# Altium schematic sheet MCU_Board_fNIRS_POWER.SchDoc
size A; SheetNumber: 2; SheetTotal: 2
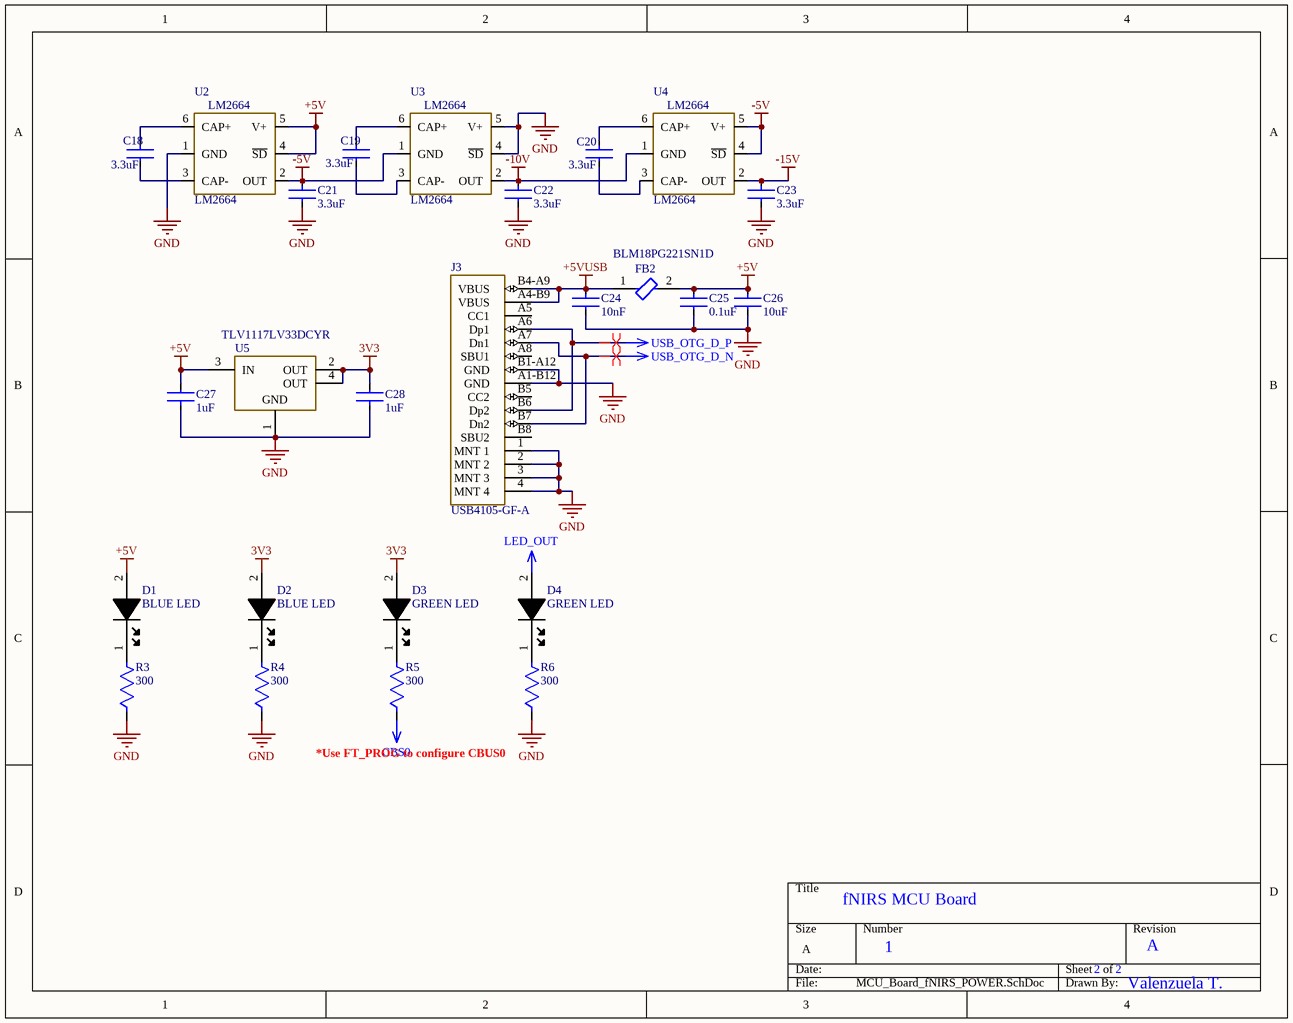
[diagram p0: MCU_Board_fNIRS_POWER.SchDoc]

## Parts
C18  3.3uF  [CAPC1210(3225)190_M]
C19  3.3uF  [CAPC1210(3225)190_M]
C20  3.3uF  [CAPC1210(3225)190_M]
C21  3.3uF  [CAPC1210(3225)190_M]
C22  3.3uF  [CAPC1210(3225)190_M]
C23  3.3uF  [CAPC1210(3225)190_M]
C24  10nF  [CAPC1206(3216)130_M]
C25  0.1uF  [CAPC3216X180N]
C26  10uF  [CAPC3216X180N]
C27  1uF  [CAPC3216X180N]
C28  1uF  [CAPC3216X180N]
D1  BLUE LED  [XZCFBB54W-1VF]
D2  BLUE LED  [XZCFBB54W-1VF]
D3  GREEN LED  [XZCFBB54W-1VF]
D4  GREEN LED  [XZCFBB54W-1VF]
FB2  BLM18PG221SN1D  [BEADC1608X95N]
J3  USB4105-GF-A  [FP-USB4105-GF-A-MFG]
R3  300  [R1206]
R4  300  [R1206]
R5  300  [R1206]
R6  300  [R1206]
U2  LM2664  [LM2664]
U3  LM2664  [LM2664]
U4  LM2664  [LM2664]
U5  TLV1117LV33DCYR  [DCY0004A_M]

## Nets
3V3: C28.2 D2.2 D3.2 U5.2(OUT) U5.4(OUT)
+5V: C25.1 C26.1 C27.2 D1.2 FB2.2 U2.4(~{SD}) U2.5(V+) U5.3(IN)
+5VUSB: C24.1 FB2.1 J3.A4-B9(VBUS) J3.B4-A9(VBUS)
-5V: C21.1 U2.2(OUT) U3.1(GND) U4.4(~{SD}) U4.5(V+)
-10V: C22.1 U3.2(OUT) U4.1(GND)
-15V: C23.1 U4.2(OUT)
CBS0: R5.1
GND: C21.2 C22.2 C23.2 C24.2 C25.2 C26.2 C27.1 C28.1 J3.1(MNT_1) J3.2(MNT_2) J3.3(MNT_3) J3.4(MNT_4) J3.A1-B12(GND) J3.B1-A12(GND) R3.1 R4.1 R6.1 U2.1(GND) U3.4(~{SD}) U3.5(V+) U5.1(GND)
LED_OUT: D4.2
USB_OTG_D_N: J3.A7(Dn1) J3.B7(Dn2)
USB_OTG_D_P: J3.A6(Dp1) J3.B6(Dp2)
NetC18_1: C18.1 U2.6(CAP+)
NetC18_2: C18.2 U2.3(CAP-)
NetC19_1: C19.1 U3.6(CAP+)
NetC19_2: C19.2 U3.3(CAP-)
NetC20_1: C20.1 U4.6(CAP+)
NetC20_2: C20.2 U4.3(CAP-)
NetD1_1: D1.1 R3.2
NetD2_1: D2.1 R4.2
NetD3_1: D3.1 R5.2
NetD4_1: D4.1 R6.2

Not connected (* = marked no-connect by the designer): J3 A5(CC1) A8(SBU1) B5(CC2) B8(SBU2)

## Layout directives
differential pair: USB_OTG_D_N, USB_OTG_D_P

## Notes on the sheet
- *Use FT_PROG to configure CBUS0
- fNIRS MCU Board
- 1
- 2
- A
- Valenzuela T.

## Library data of the parts
C18-C23 = C1210C335K5RAC7800: 1210
C24 = C1206C103KMREC7800: 10000 pF ±10% 63V Ceramic Capacitor X7R 1206 (3216 Metric); Tolerance: -20% to +80%; Value: 1uF; Case-Metric: 3216; Rated Voltage: 25 V; Case-EIA: 1206; Max Thickness: 1.3 mm; Technology: SMT
C25 = C1206C104K5RAC7210: 1206; Manufacturer: KEMET; Tolerance: 0.1; Material: Ceramic; Voltage Rating: 50 V; Temperature Characteristic: X7R; Automotive Grade: Grade 0; Capacitance: 0.10 μF; Value: 0.10 μF; Temperature Coefficient: 15%; Device Class L3: Ceramic Capacitors; ComponentLink2URL: https://content.kemet.com/datasheets/KEM_C1007_X8R_ULTRA_150C_SMD.pdf; Temperature Range Low: -55°C; RoHS: TRUE; Temperature Range High: +150°C; Automotive: Yes; Height: 0.88mm; Manufacturer Part Number: C1206C104K5RAC7210; Temperature: -55°C to +150°C; Octopart: https://octopart.com/c1206c104k5rac7210-kemet-3919856; Package: C1206C-EB; Mouser Description: Multilayer Ceramic Capacitors MLCC - SMD/SMT 50volts 0.1uF X7R 10%; Ipc Land Pattern Name: CAPC320160X78; Device Class L2: Capacitors; Category: Cap; Lead Free: Yes; ComponentLink2Description: Datasheet; Digikey Description: CAP CER 0.1UF 50V X7R 1206; Device Class L1: Passive Components
C26 = CL31B106KOHNNWE: 1206
C27 C28 = 12063G105ZAT4A: CAP 1uF 25V -20% to +80% 1206 (3216 Metric) Thickness 1.3mm; Case-Metric: 3216; Case-EIA: 1206; Tolerance: -20% to +80%; Value: 1uF; Max Thickness: 1.3 mm; Technology: SMT; Rated Voltage: 25 V
D1 D2 = XZCFBB54W-1VF: Blue 470nm LED Indication - Discrete 2.65V 0805 (2012 Metric)
D3 D4 = XZCDGK54W-1VF: Green 525nm LED Indication - Discrete 2.65V 0805 (2012 Metric)
FB2 = BLM18PG221SN1D: 220 Ohms @ 100 MHz 1 Power Line Ferrite Bead 0603 (1608 Metric) 1.4A 100mOhm; Tolerance: -20% to +80%; Value: 1uF; Case-Metric: 3216; Rated Voltage: 25 V; Case-EIA: 1206; Max Thickness: 1.3 mm; Technology: SMT
J3 = USB4105-GF-A: CONN RCPT USB2.0 TYPEC 5A; Manufacturer: GCT; Voltage Rating: 20V; Is Female: yes; Current Rating: 5/6.25/1.25/0.25A; Number Of Contacts: 16; Conn Orientation: Right Angle; Device Class L1: Connectors; Category: Conn; Lead Free: Yes; RoHS: TRUE; Temperature Range High: +85°C; Digikey Description: CONN RCPT USB2.0 TYPEC 5A; Device Class L3: unset; ComponentLink2Description: Datasheet; Manufacturer Part Number: USB4105-GF-A; Package: 0; Usb Standard: USB 2.0; Device Class L2: USB Connectors; Automotive: No; Temperature Range Low: -40°C; Height: 3.46mm; Temperature: -40°C to +85°C; Contact Material: Gold,Nickel; ComponentLink2URL: https://gct.co/files/drawings/usb4105.pdf; Octopart: https://octopart.com/usb4105-gf-a-gct-106627878
R3 R4 R6 = CRCW1206300RFKEA: 300 Ohms ±1% 0.25W, 1/4W Chip Resistor 1206 (3216 Metric) Automotive AEC-Q200 Thick Film
R5 = CRCW1206300RFKEA
U2-U4 = LM2664: Switched Capacitor Voltage Converter, 6-pin SOT-23; Manufacturer: Texas Instruments; CompType: Switch Caps; PackageTopMarking: S03A*XTT; PowerWise: N; PackageDescription: Molded SOT-23, .115 x .063 x .040in Body, 6 Lead, .0375in in Pitch; Code_IPC: SOT26A-6; PinCount: 6; PackageReference: DBV0006A; ComponentLink1URL: http://www.ti.com/general/docs/lit/getliterature.tsp?genericPartNumber=LM2664&fileType=pdf; Code_JEDEC: MO-178-AB; ComponentLink1Description: Datasheet URL; RoHS: N
U5 = CMP-0395-00503-2: Single Output LDO, 1 A, Fixed 3.3 V Output, 2 to 5.5 V Input, 4-pin SOT-223 (DCY), -40 to 125 degC, Green (RoHS & no Sb/Br); Manufacturer: Texas Instruments; Vout Adj(Min)(V): 3.3; Vdo(Typ)(mV): 1200; Iq(Typ)(mA): 0.05; Accuracy(%): 2; Iout(Max)(A): 1; SubFamily: Single Channel LDO; Vin(Max)(V): 5.5; PackageReference: DCY0004A; PackageDescription: 4-Pin Plastic Small Outline, Body 3.5 x 6.5 mm, Pitch 2.3 mm; Vout Adj(Max)(V): 3.3; Mounting Technology: Surface Mount; ComponentLink2Description: Datasheet; ComponentLink1Description: Manufacturer URL; PartNumber: TLV1117LV33DCYR; ComponentLink3Description: Package Specification; ComponentLink1URL: http://www.ti.com/; ComponentLink2URL: http://www.ti.com/general/docs/lit/getliterature.tsp?genericPartNumber=TLV1117LV33&fileType=pdf; Fixed Output Options(V): 3.3; PackageVersion: 4202506/B; Vin(Min)(V): 2; DatasheetVersion: SBVS160A; Eco-Plan: Green (RoHS & no Sb/Br); ComponentLink3URL: http://www.ti.com/litv/pdf/mpds094a; Code_JEDEC: TO-261